# Altium schematic sheet adc_chanels.SchDoc
size A4
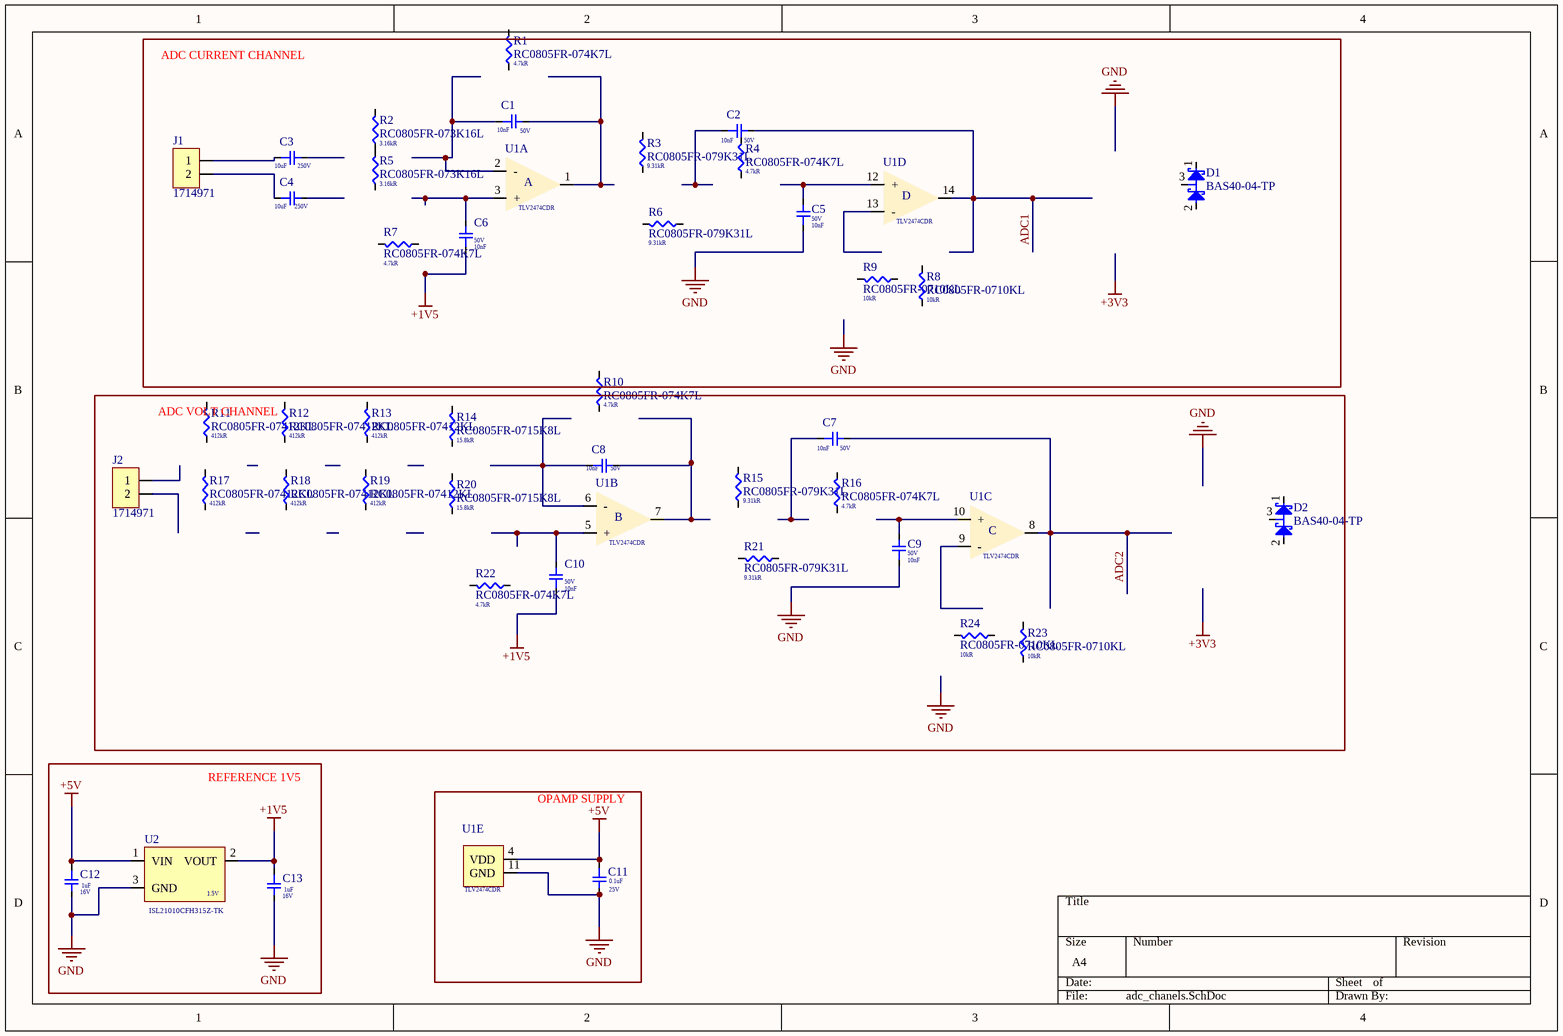
[diagram p0: adc_chanels.SchDoc]

## Parts
C1  Voltage: 50V  Capacitance: 10nF  [CAP smd 0805]  (hidden comment: CAP_GRM2195C1H103FA01D_MURATA)
C2  Voltage: 50V  Capacitance: 10nF  [CAP smd 0805]  (hidden comment: CAP_GRM2195C1H103FA01D_MURATA)
C3  Voltage Rating (AC): 250V  Capacitance: 10uF  [Cap 22x36.5x31.5]  (hidden comment: CAP_B32754C2106K000)
C4  Voltage Rating (AC): 250V  Capacitance: 10uF  [Cap 22x36.5x31.5]  (hidden comment: CAP_B32754C2106K000)
C5  Voltage: 50V  Capacitance: 10nF  [CAP smd 0805]  (hidden comment: CAP_GRM2195C1H103FA01D_MURATA)
C6  Voltage: 50V  Capacitance: 10nF  [CAP smd 0805]  (hidden comment: CAP_GRM2195C1H103FA01D_MURATA)
C7  Voltage: 50V  Capacitance: 10nF  [CAP smd 0805]  (hidden comment: CAP_GRM2195C1H103FA01D_MURATA)
C8  Voltage: 50V  Capacitance: 10nF  [CAP smd 0805]  (hidden comment: CAP_GRM2195C1H103FA01D_MURATA)
C9  Voltage: 50V  Capacitance: 10nF  [CAP smd 0805]  (hidden comment: CAP_GRM2195C1H103FA01D_MURATA)
C10  Voltage: 50V  Capacitance: 10nF  [CAP smd 0805]  (hidden comment: CAP_GRM2195C1H103FA01D_MURATA)
C11  Voltage Rating: 25V  Capacitance: 0.1uF  [CAP smd 0805]  (hidden comment: CAP_CC0805KRX7R8BB104_YAGEO)
C12  Voltage Rating: 16V  Capacitance: 1uF  [CAP smd 0805]  (hidden comment: CAP_CC0805KKX7R7BB105_YAGEO)
C13  Voltage Rating: 16V  Capacitance: 1uF  [CAP smd 0805]  (hidden comment: CAP_CC0805KKX7R7BB105_YAGEO)
D1  BAS40-04-TP  [SOT-23]
D2  BAS40-04-TP  [SOT-23]
J1  1714971
J2  1714971
R1  RC0805FR-074K7L  Resistance: 4.7kR  [res 0805]
R2  RC0805FR-073K16L  Resistance: 3.16kR  [res 0805]
R3  RC0805FR-079K31L  Resistance: 9.31kR  [res 0805]
R4  RC0805FR-074K7L  Resistance: 4.7kR  [res 0805]
R5  RC0805FR-073K16L  Resistance: 3.16kR  [res 0805]
R6  RC0805FR-079K31L  Resistance: 9.31kR  [res 0805]
R7  RC0805FR-074K7L  Resistance: 4.7kR  [res 0805]
R8  RC0805FR-0710KL  Resistance: 10kR  [res 0805]
R9  RC0805FR-0710KL  Resistance: 10kR  [res 0805]
R10  RC0805FR-074K7L  Resistance: 4.7kR  [res 0805]
R11  RC0805FR-07412KL  Resistance: 412kR  [res 0805]
R12  RC0805FR-07412KL  Resistance: 412kR  [res 0805]
R13  RC0805FR-07412KL  Resistance: 412kR  [res 0805]
R14  RC0805FR-0715K8L  Resistance: 15.8kR  [res 0805]
R15  RC0805FR-079K31L  Resistance: 9.31kR  [res 0805]
R16  RC0805FR-074K7L  Resistance: 4.7kR  [res 0805]
R17  RC0805FR-07412KL  Resistance: 412kR  [res 0805]
R18  RC0805FR-07412KL  Resistance: 412kR  [res 0805]
R19  RC0805FR-07412KL  Resistance: 412kR  [res 0805]
R20  RC0805FR-0715K8L  Resistance: 15.8kR  [res 0805]
R21  RC0805FR-079K31L  Resistance: 9.31kR  [res 0805]
R22  RC0805FR-074K7L  Resistance: 4.7kR  [res 0805]
R23  RC0805FR-0710KL  Resistance: 10kR  [res 0805]
R24  RC0805FR-0710KL  Resistance: 10kR  [res 0805]
U1  TLV2474CDR  (value not drawn)  (parts A,B,C,D,E of 5)
U2  Reference Voltage: 1.5V  (hidden comment: ISL21010CFH315Z-TK)

## Blocks framed on the sheet
ADC CURRENT CHANNEL: C1-C6 D1 J1 R1-R9 U1
ADC VOLT CHANNEL: C7-C10 D2 J2 R11-R24 U1
REFERENCE 1V5: C12 C13 U2
OPAMP SUPPLY: C11 U1

## Nets
+1V5: C6.23 C10.23 C13.23 U2.2(VOUT)
+5V: C11.23 C12.23 U1.4(VDD) U2.1(VIN)
GND: C5.23 C9.23 C11.22 C12.22 C13.22 U1.11(GND) U2.3(GND)
ADC1: C2.22 U1.14
ADC2: C7.22 U1.8
NetC1_22: C1.22 U1.1
NetC1_23: C1.23 U1.2(-)
NetC3_23: C3.23 J1.1
NetC4_23: C4.23 J1.2
NetC5_22: C5.22 U1.12(+)
NetC6_22: C6.22 U1.3(+)
NetC8_22: C8.22 U1.7
NetC8_23: C8.23 U1.6(-)
NetC9_22: C9.22 U1.10(+)
NetC10_22: C10.22 U1.5(+)
NetR2_2: R2.2 R5.1

Not connected (* = marked no-connect by the designer): C2 23; C3 22; C4 22; C7 23; D1 1 2 3; D2 1 2 3; J2 1 2; R1 1 2; R2 1; R3 1 2; R4 1 2; R5 2; R6 1 2; R7 1 2; R8 1 2; R9 1 2; R10 1 2; R11 1 2; R12 1 2; R13 1 2; R14 1 2; R15 1 2; R16 1 2; R17 1 2; R18 1 2; R19 1 2; R20 1 2; R21 1 2; R22 1 2; R23 1 2; R24 1 2; U1 9(-) 13(-)

## Notes on the sheet
- (in symbol TLV2474CDR, part A) A
- (in symbol TLV2474CDR, part B) B
- (in symbol TLV2474CDR, part C) C

## Library data of the parts
C1 C2 C5-C10 = CAP_GRM2195C1H103FA01D_MURATA: 0805 10 nF 50 V ±1% Tolerance C0G SMD Multilayer Ceramic Capacitor; Manufacturer 1: Murata; Temperature Coefficient: 30ppm/°C; Supplier 1: Arrow Electronics; Manufacturer Part Number 1: GRM2195C1H103FA01D; Stock 1: 3; Pricing 1: 1=0,54310 (USD); RoHS: Yes; Mount: Surface Mount; Case/Package: 0805; Case Code (Imperial): 0805; Case Code (Metric): 2012; Min Operating Temperature: -55°C; Max Operating Temperature: 125°C; Tolerance: 1%; Dielectric: C0G; Packaging: Tape and Reel; Voltage Rating: 50V; Voltage Rating (DC): 50V; Package Quantity: 4000; Termination: SMD/SMT; Series: GRM; Construction: Flat; Length: 2mm; Width: 1.25mm; Height: 0.85mm; Depth: 1.25mm; Thickness: 0.037inch; Radiation Hardening: No; REACH SVHC: No SVHC; Lead Free: Lead Free; RoHS Compliant: Yes; ComponentLink1URL: https://datasheet.ciiva.com/29542/partnumbering-e-01-29542571.pdf?src-supplier=Digi-Key; ComponentLink1Description: https://datasheet.ciiva.com/29542/partnumbering-e-01-29542571.pdf?src-supplier=Digi-Key; ComponentLink2URL: https://datasheet.ciiva.com/29542/partnumbering-e-01-29542569.pdf?src-supplier=Digi-Key; ComponentLink2Description: https://datasheet.ciiva.com/29542/partnumbering-e-01-29542569.pdf?src-supplier=Digi-Key; ComponentLink3URL: https://datasheet.ciiva.com/29542/partnumbering-e-01-29542570.pdf?src-supplier=Digi-Key; ComponentLink3Description: https://datasheet.ciiva.com/29542/partnumbering-e-01-29542570.pdf?src-supplier=Digi-Key; ComponentLink4URL: https://datasheet.ciiva.com/17452/c02e-17452856.pdf?src-supplier=Avnet+Europe; ComponentLink4Description: https://datasheet.ciiva.com/17452/c02e-17452856.pdf?src-supplier=Avnet+Europe; ComponentLink5URL: https://datasheet.ciiva.com/16497/c02e-16497047.pdf?src-supplier=Future+Electronics; ComponentLink5Description: https://datasheet.ciiva.com/16497/c02e-16497047.pdf?src-supplier=Future+Electronics; Supplier Part Number 1: GRM2195C1H103FA01D
C3 C4 = CAP_B32754C2106K000: Cap Film 10uF 500V PP 10% (31.5 X 22 X 36.5mm) Dipped Radial 27.5mm 105°C Bulk; Manufacturer 1: TDK EPCOS; ESR (Equivalent Series Resistance): 4.2mR; Supplier 1: Digi-Key; Manufacturer Part Number 1: B32754C2106K000; Stock 1: 0; Pricing 1: 1=5,13000, 10=4,62000, 50=4,00380, 100=3,49040, 500=2,87448, 1000=2,66916, 2500=2,61783 (USD); RoHS: No; Mount: Through Hole; Case/Package: Radial; Dielectric Material: PP; Min Operating Temperature: -40°C; Max Operating Temperature: 105°C; Packaging: Bulk; Tolerance: 10%; Voltage Rating (DC): 500V; Termination: PC Pins; RoHS Compliant: No; ComponentLink1URL: https://en.tdk.eu/inf/20/20/ds/MKP_B32754_758.pdf?src-supplier=Digi-Key; ComponentLink1Description: https://en.tdk.eu/inf/20/20/ds/MKP_B32754_758.pdf?src-supplier=Digi-Key; Supplier Part Number 1: 495-76101-ND
C11 = CAP_CC0805KRX7R8BB104_YAGEO: CAPACITOR, 0805, 100NF, 25V, REEL 4000; Manufacturer 1: Yageo; Material: Ceramic; Tolerance: 10%; Dielectric: X7R; Insulation Resistance: 100GR; Supplier 1: Digi-Key; Manufacturer Part Number 1: CC0805KRX7R8BB104; Stock 1: 278639; Pricing 1: 1=0,12000, 10=0,08800, 50=0,04980, 100=0,04130, 500=0,02894, 1000=0,02396 (USD); RoHS: Yes; Mount: Surface Mount; Case/Package: 0805; Number of Pins: 2; Case Code (Metric): 2012; Case Code (Imperial): 0805; Min Operating Temperature: -55°C; Max Operating Temperature: 125°C; Package Quantity: 1; Packaging: Tape and Reel; Voltage Rating (DC): 25V; Termination: SMD/SMT; Resistor Type: Ceramic; Series: CC; Length: 2mm; Width: 0.049inch; Height: 0.85mm; Thickness: 0.033inch; Depth: 1.25mm; Radiation Hardening: No; REACH SVHC: No SVHC; Lead Free: Lead Free; Halogen Free: Halogen Free; RoHS Compliant: Yes; ComponentLink1URL: https://datasheet.ciiva.com/8034/70765-8034031.pdf?src-supplier=Element14; ComponentLink1Description: https://datasheet.ciiva.com/8034/70765-8034031.pdf?src-supplier=Element14; ComponentLink2URL: https://datasheet.ciiva.com/28450/1489800-28450789.pdf?src-supplier=Element14; ComponentLink2Description: https://datasheet.ciiva.com/28450/1489800-28450789.pdf?src-supplier=Element14; ComponentLink3URL: https://datasheet.ciiva.com/46430/1850775-46430166.pdf?src-supplier=Element14; ComponentLink3Description: https://datasheet.ciiva.com/46430/1850775-46430166.pdf?src-supplier=Element14; ComponentLink4URL: https://datasheet.ciiva.com/145/mlccorderingcode-145008.pdf?src-supplier=Digi-Key; ComponentLink4Description: https://datasheet.ciiva.com/145/mlccorderingcode-145008.pdf?src-supplier=Digi-Key; ComponentLink5URL: https://datasheet.ciiva.com/145/mlccorderingcode-145007.pdf?src-supplier=Digi-Key; ComponentLink5Description: https://datasheet.ciiva.com/145/mlccorderingcode-145007.pdf?src-supplier=Digi-Key; ComponentLink6URL: https://datasheet.ciiva.com/145/mlccorderingcode-145009.pdf?src-supplier=Digi-Key; ComponentLink6Description: https://datasheet.ciiva.com/145/mlccorderingcode-145009.pdf?src-supplier=Digi-Key; ComponentLink7URL: https://datasheet.ciiva.com/8034/1784427-8034030.pdf?src-supplier=Element14; ComponentLink7Description: https://datasheet.ciiva.com/8034/1784427-8034030.pdf?src-supplier=Element14; ComponentLink8URL: https://datasheet.ciiva.com/8034/1784427-8034029.pdf?src-supplier=Element14; ComponentLink8Description: https://datasheet.ciiva.com/8034/1784427-8034029.pdf?src-supplier=Element14; ComponentLink9URL: https://datasheet.ciiva.com/15189/getdatasheetpartid-330244-15189223.pdf?src-supplier=Verical; ComponentLink9Description: https://datasheet.ciiva.com/15189/getdatasheetpartid-330244-15189223.pdf?src-supplier=Verical; ComponentLink10URL: https://datasheet.ciiva.com/16625/upy-gphc-x7r-6-3v-to-50v-8-16625546.pdf?src-supplier=Avnet+Europe; ComponentLink10Description: https://datasheet.ciiva.com/16625/upy-gphc-x7r-6-3v-to-50v-8-16625546.pdf?src-supplier=Avnet+Europe; Supplier Part Number 1: 311-1141-1-ND
C12 C13 = CAP_CC0805KKX7R7BB105_YAGEO: YAGEO   CC0805KKX7R7BB105   CERAMIC CAPACITOR, 1UF, 16V, X7R, 10%, 0805; Supplier 1: Digi-Key; Manufacturer 1: Yageo; Manufacturer Part Number 1: CC0805KKX7R7BB105; Stock 1: 516899; Pricing 1: 1=0,16000, 10=0,11700, 50=0,06640, 100=0,05500, 500=0,03858, 1000=0,03194 (USD); RoHS: Yes; Mount: Surface Mount; Case/Package: 0805; Case Code (Metric): 2012; Case Code (Imperial): 0805; Min Operating Temperature: -55°C; Max Operating Temperature: 125°C; Tolerance: 10%; Dielectric: X7R; Series: CC; Packaging: Tape and Reel; Package Quantity: 1; Termination: SMD/SMT; Voltage Rating (DC): 16V; Length: 2mm; Width: 0.049inch; Depth: 1.25mm; Thickness: 0.049inch; Radiation Hardening: No; REACH SVHC: No SVHC; Lead Free: Lead Free; Halogen Free: Halogen Free; RoHS Compliant: Yes; ComponentLink1URL: https://datasheet.ciiva.com/144/mlccorderingcode-144902.pdf?src-supplier=Digi-Key; ComponentLink1Description: https://datasheet.ciiva.com/144/mlccorderingcode-144902.pdf?src-supplier=Digi-Key; ComponentLink2URL: https://datasheet.ciiva.com/144/mlccorderingcode-144903.pdf?src-supplier=Digi-Key; ComponentLink2Description: https://datasheet.ciiva.com/144/mlccorderingcode-144903.pdf?src-supplier=Digi-Key; ComponentLink3URL: https://datasheet.ciiva.com/144/mlccorderingcode-144904.pdf?src-supplier=Digi-Key; ComponentLink3Description: https://datasheet.ciiva.com/144/mlccorderingcode-144904.pdf?src-supplier=Digi-Key; ComponentLink4URL: https://datasheet.ciiva.com/11464/upy-gphc-x7r-6-3v-to-50v-8-11464750.pdf?src-supplier=Avnet; ComponentLink4Description: https://datasheet.ciiva.com/11464/upy-gphc-x7r-6-3v-to-50v-8-11464750.pdf?src-supplier=Avnet; ComponentLink5URL: https://datasheet.ciiva.com/13173/upy-gp-np0-16v-to-50v-8-3714-13173254.pdf?src-supplier=Mouser; ComponentLink5Description: https://datasheet.ciiva.com/13173/upy-gp-np0-16v-to-50v-8-3714-13173254.pdf?src-supplier=Mouser; ComponentLink6URL: https://datasheet.ciiva.com/7978/1489800-7978201.pdf?src-supplier=Element14; ComponentLink6Description: https://datasheet.ciiva.com/7978/1489800-7978201.pdf?src-supplier=Element14; ComponentLink7URL: https://datasheet.ciiva.com/28450/1489800-28450750.pdf?src-supplier=Element14; ComponentLink7Description: https://datasheet.ciiva.com/28450/1489800-28450750.pdf?src-supplier=Element14; ComponentLink8URL: https://datasheet.ciiva.com/15189/getdatasheetpartid-251802-15189206.pdf?src-supplier=Verical; ComponentLink8Description: https://datasheet.ciiva.com/15189/getdatasheetpartid-251802-15189206.pdf?src-supplier=Verical; Supplier Part Number 1: 311-1365-1-ND
D1 D2 = BAS40-04-TP: DIODE ARRAY SCHOTTKY 40V SOT23; Manufacturer 1: MCC; Max Surge Current: 600mA; Recovery Time: 5ns; Forward Current: 200mA; Forward Voltage: 1V; Max Reverse Leakage Current: 200nA; Power Dissipation: 200mW; Element Configuration: Single; Capacitance: 5pF; Supplier 1: Digi-Key; Manufacturer Part Number 1: BAS40-04-TP; Stock 1: 0; Pricing 1: 1=0,26000, 10=0,21300, 100=0,11290, 500=0,07424, 1000=0,05049 (USD); RoHS: Yes; Mount: Surface Mount; Case/Package: SOT-23; Number of Pins: 3; Min Operating Temperature: -55°C; Max Operating Temperature: 125°C; Package Quantity: 3000; Packaging: Tape and Reel; Average Rectified Current: 200mA; Reverse Recovery Time: 5ns; Max Forward Surge Current (Ifsm): 600mA; Max Reverse Current: 200nA; Max Repetitive Reverse Voltage (Vrrm): 40V; Peak Non-Repetitive Surge Current: 600mA; Max Reverse Voltage (DC): 40V; Series: -; Length: 3.04mm; Width: 1.4mm; Height: 1.02mm; Radiation Hardening: No; REACH SVHC: Unknown; Lead Free: Lead Free; RoHS Compliant: Yes; ComponentLink1URL: https://datasheet.ciiva.com/4716/bas40-bas70sot-23-28891-4716000.pdf?src-supplier=Mouser; ComponentLink1Description: https://datasheet.ciiva.com/4716/bas40-bas70sot-23-28891-4716000.pdf?src-supplier=Mouser; ComponentLink2URL: https://datasheet.ciiva.com/23684/1684803-23684306.pdf?src-supplier=Newark; ComponentLink2Description: https://datasheet.ciiva.com/23684/1684803-23684306.pdf?src-supplier=Newark; ComponentLink3URL: https://datasheet.ciiva.com/906/bas40-bas70sot-23-906318.pdf?src-supplier=Digi-Key; ComponentLink3Description: https://datasheet.ciiva.com/906/bas40-bas70sot-23-906318.pdf?src-supplier=Digi-Key; ComponentLink4URL: https://datasheet.ciiva.com/906/bas40-bas70sot-23-906319.pdf?src-supplier=Digi-Key; ComponentLink4Description: https://datasheet.ciiva.com/906/bas40-bas70sot-23-906319.pdf?src-supplier=Digi-Key; ComponentLink5URL: https://datasheet.ciiva.com/906/bas40-bas70sot-23-906320.pdf?src-supplier=Digi-Key; ComponentLink5Description: https://datasheet.ciiva.com/906/bas40-bas70sot-23-906320.pdf?src-supplier=Digi-Key; ComponentLink6URL: https://datasheet.ciiva.com/7624/1684803-7624699.pdf?src-supplier=Element14; ComponentLink6Description: https://datasheet.ciiva.com/7624/1684803-7624699.pdf?src-supplier=Element14; ComponentLink7URL: https://datasheet.ciiva.com/15200/getdatasheetpartid-226544-15200426.pdf?src-supplier=Verical; ComponentLink7Description: https://datasheet.ciiva.com/15200/getdatasheetpartid-226544-15200426.pdf?src-supplier=Verical; Supplier Part Number 1: BAS40-04TPMSDKR-ND
J1 J2 = 1714971: Large Style 2pos 32a 500vac 24-10awg Green Plastic Interlocking Housing 9.5.0mm Pitch; Manufacturer 1: Phoenix Contact; Number of Poles: 2; Voltage Rating: 1kV; Max Supply Voltage: 690V; Number of Levels: 1; Current: 30A; Voltage: 600V; Connector Type: PCB,Terminal Block; Gender: Male; Wire Gauge (Max): 24AWG; Wire Gauge (Min): 10AWG; Pitch: 0.375inch; Stripping Length: 8mm; Approvals: UL,CSA,cULus,EAC; Supplier 1: Digi-Key; Manufacturer Part Number 1: 1714971; Stock 1: 16891; Pricing 1: 1=1,79000, 10=1,74400, 50=1,63000, 100=1,49960, 250=1,38552, 500=1,32030, 1000=1,25510 (USD); RoHS: Yes; Mount: Through Hole; Number of Pins: 2; Color: Green; Weight: 0.228928oz; Housing Color: Green; Housing Material: Polyamide; Insulation Material: Nylon; Contact Material: Tin; Material: Polyamide; Packaging: Bulk; Max Current Rating: 32A; Package Quantity: 50; Number of Rows: 1; Current Rating: 32A; Number of Positions Per Level: 2; Termination: Screw; Number of Positions: 2; Number of Contacts: 2; Number of Circuits: 2; Orientation: Straight; Series: MKDS; Length: 19.04mm; Width: 21.5mm; Height: 21.5mm; Wire/Cable Gauge: 24AWG; Depth: 12.5mm; Radiation Hardening: No; RoHS Compliant: Yes; Lead Free: Lead Free; Flammability Rating: UL94 V-0; REACH SVHC: No SVHC; ComponentLink1URL: https://datasheet.ciiva.com/823/1714971-823798.pdf?src-supplier=Digi-Key; ComponentLink1Description: https://datasheet.ciiva.com/823/1714971-823798.pdf?src-supplier=Digi-Key; ComponentLink2URL: https://datasheet.ciiva.com/16071/1714971-16071957.pdf?src-supplier=Onlinecomponents.com; ComponentLink2Description: https://datasheet.ciiva.com/16071/1714971-16071957.pdf?src-supplier=Onlinecomponents.com; ComponentLink3URL: https://datasheet.ciiva.com/15169/getdatasheetpartid-177884-15169654.pdf?src-supplier=Verical; ComponentLink3Description: https://datasheet.ciiva.com/15169/getdatasheetpartid-177884-15169654.pdf?src-supplier=Verical; ComponentLink4URL: https://datasheet.ciiva.com/1118/100944-1118424.pdf?src-supplier=Element14; ComponentLink4Description: https://datasheet.ciiva.com/1118/100944-1118424.pdf?src-supplier=Element14; ComponentLink5URL: https://datasheet.ciiva.com/29218/744593-da-01-en-printklemme-mkds-5-2-9-5-29218293.pdf?src-supplier=Conrad; ComponentLink5Description: https://datasheet.ciiva.com/29218/744593-da-01-en-printklemme-mkds-5-2-9-5-29218293.pdf?src-supplier=Conrad; Supplier Part Number 1: 277-1271-ND
R1 R4 R7 R10 R16 R22 = RC0805FR-074K7L: YAGEO - RC0805FR-074K7L - SMD  0805 [2012 Metric], 4.7 kohm,  125 mW; Tolerance: 1%; Temperature Coefficient: 100ppm/°C; Voltage Rating (DC): 150V; Power Rating: 125mW; Supplier 1: RSComponents; Manufacturer 1: Yageo; Manufacturer Part Number 1: RC0805FR-074K7L; Stock 1: 55000; Pricing 1: 5000=0,00500 (GBP); RoHS: Yes; Case/Package: 0805; Number of Pins: 2; Case Code (Metric): 2012; Case Code (Imperial): 0805; Size Code: 0805; Min Operating Temperature: -55°C; Max Operating Temperature: 155°C; Resistor Type: Thick Film; Packaging: Tape and Reel; Package Quantity: 5000; Voltage Rating: 150V; Number of Terminations: 2; Termination: SMD/SMT; Max Power Dissipation: 125mW; Features: Moisture Resistant; Series: RC; Resistance Tolerance: 1%; Technology: THICK FILM; Construction: Rectangular; Length: 0.079inch; Width: 0.049inch; Height: 0.024inch; Depth: 1.25mm; REACH SVHC: No SVHC; Lead Free: Lead Free; RoHS Compliant: Yes; Military Standard: Not; ComponentLink1URL: https://datasheet.ciiva.com/11808/0900766b8106beab-11808155.pdf?src-supplier=RSComponents; ComponentLink1Description: https://datasheet.ciiva.com/11808/0900766b8106beab-11808155.pdf?src-supplier=RSComponents; ComponentLink2URL: https://datasheet.ciiva.com/6547/pyu-r-int-thick-7-6547263.pdf?src-supplier=Digi-Key; ComponentLink2Description: https://datasheet.ciiva.com/6547/pyu-r-int-thick-7-6547263.pdf?src-supplier=Digi-Key; ComponentLink3URL: https://datasheet.ciiva.com/7941/444164-7941806.pdf?src-supplier=Element14; ComponentLink3Description: https://datasheet.ciiva.com/7941/444164-7941806.pdf?src-supplier=Element14; ComponentLink4URL: https://datasheet.ciiva.com/46447/444164-46447583.pdf?src-supplier=Element14; ComponentLink4Description: https://datasheet.ciiva.com/46447/444164-46447583.pdf?src-supplier=Element14; ComponentLink5URL: https://datasheet.ciiva.com/7941/444164-7941804.pdf?src-supplier=Element14; ComponentLink5Description: https://datasheet.ciiva.com/7941/444164-7941804.pdf?src-supplier=Element14; ComponentLink6URL: https://datasheet.ciiva.com/7941/1686128-7941805.pdf?src-supplier=Element14; ComponentLink6Description: https://datasheet.ciiva.com/7941/1686128-7941805.pdf?src-supplier=Element14; Supplier Part Number 1: 6181408
R2 R5 = RC0805FR-073K16L: Res Thick Film smd 0805 3.16K Ohm 1% 0.125W(1/8W); Manufacturer 1: Yageo; Power Rating: 125mW; Voltage Rating: 150V; Temperature Coefficient: 100ppm/°C; Supplier 1: Digi-Key; Manufacturer Part Number 1: RC0805FR-073K16L; Stock 1: 24399; Pricing 1: 1=0,10000, 10=0,04200, 100=0,01690, 1000=0,00759, 2500=0,00659 (USD); RoHS: Yes; Case/Package: 0805; Case Code (Metric): 2012; Case Code (Imperial): 0805; Weight: 0.000194oz; Size Code: 0805; Min Operating Temperature: -55°C; Max Operating Temperature: 155°C; Tolerance: 1%; Package Quantity: 1; Packaging: Tape and Reel; Resistor Type: Thick Film; Number of Terminations: 2; Termination: SMD/SMT; Max Power Dissipation: 125mW; Voltage Rating (DC): 150V; Features: Moisture Resistant; Series: RC; Construction: Rectangular; Length: 2mm; Width: 0.049inch; Height: 0.024inch; Depth: 1.25mm; Military Standard: Not; Lead Free: Lead Free; RoHS Compliant: Yes; ComponentLink1URL: https://datasheet.ciiva.com/2457/pyu-r-int-thick-7-2457284.pdf?src-supplier=Digi-Key; ComponentLink1Description: https://datasheet.ciiva.com/2457/pyu-r-int-thick-7-2457284.pdf?src-supplier=Digi-Key; ComponentLink2URL: https://datasheet.ciiva.com/2457/pyu-r-int-thick-7-2457285.pdf?src-supplier=Digi-Key; ComponentLink2Description: https://datasheet.ciiva.com/2457/pyu-r-int-thick-7-2457285.pdf?src-supplier=Digi-Key; ComponentLink3URL: https://datasheet.ciiva.com/2457/pyu-r-int-thick-7-2457286.pdf?src-supplier=Digi-Key; ComponentLink3Description: https://datasheet.ciiva.com/2457/pyu-r-int-thick-7-2457286.pdf?src-supplier=Digi-Key; ComponentLink4URL: https://datasheet.ciiva.com/12577/rc0805-12577436.pdf?src-supplier=Mouser; ComponentLink4Description: https://datasheet.ciiva.com/12577/rc0805-12577436.pdf?src-supplier=Mouser; Supplier Part Number 1: 311-3.16KCRCT-ND
R3 R6 R15 R21 = RC0805FR-079K31L: Res Thick Film smd 0805 9.31K Ohm 1% 0.125W(1/8W); Manufacturer 1: Yageo; Temperature Coefficient: 100ppm/°C; Power Rating: 125mW; Voltage Rating: 150V; Supplier 1: Digi-Key; Manufacturer Part Number 1: RC0805FR-079K31L; Stock 1: 10181; Pricing 1: 1=0,10000, 10=0,04200, 100=0,01690, 1000=0,00759, 2500=0,00659 (USD); RoHS: Yes; Case/Package: 0805; Contact Plating: Tin,Lead,Matte; Case Code (Imperial): 0805; Case Code (Metric): 2012; Size Code: 0805; Min Operating Temperature: -55°C; Max Operating Temperature: 155°C; Tolerance: 1%; Resistor Type: Thick Film; Packaging: Tape and Reel; Package Quantity: 1; Termination: SMD/SMT; Number of Terminations: 2; Max Power Dissipation: 125mW; Voltage Rating (DC): 150V; Features: Moisture Resistant; Series: RC; Construction: Rectangular; Length: 2mm; Width: 1.25mm; Height: 0.024inch; Depth: 1.25mm; Radiation Hardening: No; Military Standard: Not; Lead Free: Lead Free; RoHS Compliant: Yes; ComponentLink1URL: https://datasheet.ciiva.com/2457/pyu-r-int-thick-7-2457635.pdf?src-supplier=Digi-Key; ComponentLink1Description: https://datasheet.ciiva.com/2457/pyu-r-int-thick-7-2457635.pdf?src-supplier=Digi-Key; ComponentLink2URL: https://datasheet.ciiva.com/2457/pyu-r-int-thick-7-2457636.pdf?src-supplier=Digi-Key; ComponentLink2Description: https://datasheet.ciiva.com/2457/pyu-r-int-thick-7-2457636.pdf?src-supplier=Digi-Key; ComponentLink3URL: https://datasheet.ciiva.com/2457/pyu-r-int-thick-7-2457637.pdf?src-supplier=Digi-Key; ComponentLink3Description: https://datasheet.ciiva.com/2457/pyu-r-int-thick-7-2457637.pdf?src-supplier=Digi-Key; ComponentLink4URL: https://datasheet.ciiva.com/17074/rc0805-17074679.pdf?src-supplier=Future+Electronics; ComponentLink4Description: https://datasheet.ciiva.com/17074/rc0805-17074679.pdf?src-supplier=Future+Electronics; Supplier Part Number 1: 311-9.31KCRCT-ND
R8 R9 R23 R24 = RC0805FR-0710KL: RES SMD  0805 10K OHM 1% 1/8W; Manufacturer 1: Yageo; Temperature Coefficient: 100ppm/°C; Power Rating: 125mW; Voltage Rating: 150V; Supplier 1: Digi-Key; Manufacturer Part Number 1: RC0805FR-0710KL; Stock 1: 7813114; Pricing 1: 1=0,10000, 10=0,04200, 100=0,01690, 1000=0,00759, 2500=0,00659 (USD); RoHS: Yes; Case/Package: 0805; Case Code (Imperial): 0805; Case Code (Metric): 2012; Size Code: 0805; Min Operating Temperature: -55°C; Max Operating Temperature: 155°C; Tolerance: 1%; Resistor Type: Thick Film; Packaging: Tape and Reel; Package Quantity: 1; Termination: SMD/SMT; Number of Terminations: 2; Max Power Dissipation: 125mW; Features: Moisture Resistant; Series: RC; Construction: Rectangular; Resistance Tolerance: 1%; Technology: THICK FILM; Length: 2mm; Width: 0.049inch; Height: 0.024inch; Depth: 1.25mm; REACH SVHC: Unknown; Military Standard: Not; Lead Free: Lead Free; RoHS Compliant: Yes; ComponentLink1URL: https://datasheet.ciiva.com/11808/0900766b8106beab-11808151.pdf?src-supplier=RSComponents; ComponentLink1Description: https://datasheet.ciiva.com/11808/0900766b8106beab-11808151.pdf?src-supplier=RSComponents; ComponentLink2URL: https://datasheet.ciiva.com/12669/rc0805-12669688.pdf?src-supplier=Mouser; ComponentLink2Description: https://datasheet.ciiva.com/12669/rc0805-12669688.pdf?src-supplier=Mouser; ComponentLink3URL: https://datasheet.ciiva.com/2456/pyu-r-int-thick-7-2456974.pdf?src-supplier=Digi-Key; ComponentLink3Description: https://datasheet.ciiva.com/2456/pyu-r-int-thick-7-2456974.pdf?src-supplier=Digi-Key; ComponentLink4URL: https://datasheet.ciiva.com/2456/pyu-r-int-thick-7-2456972.pdf?src-supplier=Digi-Key; ComponentLink4Description: https://datasheet.ciiva.com/2456/pyu-r-int-thick-7-2456972.pdf?src-supplier=Digi-Key; ComponentLink5URL: https://datasheet.ciiva.com/2456/pyu-r-int-thick-7-2456973.pdf?src-supplier=Digi-Key; ComponentLink5Description: https://datasheet.ciiva.com/2456/pyu-r-int-thick-7-2456973.pdf?src-supplier=Digi-Key; ComponentLink6URL: https://datasheet.ciiva.com/16747/rc0805-16747087.pdf?src-supplier=Future+Electronics; ComponentLink6Description: https://datasheet.ciiva.com/16747/rc0805-16747087.pdf?src-supplier=Future+Electronics; ComponentLink7URL: https://datasheet.ciiva.com/46447/444164-46447563.pdf?src-supplier=Element14; ComponentLink7Description: https://datasheet.ciiva.com/46447/444164-46447563.pdf?src-supplier=Element14; Supplier Part Number 1: 311-10.0KCRCT-ND
R11-R13 R17-R19 = RC0805FR-07412KL: RES SMD 0805 412K OHM 1% 1/8W; Manufacturer 1: Yageo; Power Rating: 125mW; Voltage Rating: 150V; Temperature Coefficient: 100ppm/°C; Supplier 1: Digi-Key; Manufacturer Part Number 1: RC0805FR-07412KL; Stock 1: 1412; Pricing 1: 1=0,10000, 10=0,04200, 100=0,01690, 1000=0,00759, 2500=0,00659 (USD); RoHS: Yes; Case/Package: 0805; Case Code (Imperial): 0805; Case Code (Metric): 2012; Min Operating Temperature: -55°C; Max Operating Temperature: 155°C; Packaging: Tape and Reel; Tolerance: 1%; Termination: SMD/SMT; Resistor Type: Thick Film; Voltage Rating (DC): 150V; Working Voltage: 150V; Number of Terminations: 2; Features: Moisture Resistant; Series: RC; Max Power Dissipation: 125mW; Technology: THICK FILM; Construction: Rectangular; Length: 2mm; Width: 1.25mm; Height: 0.5mm; Depth: 1.25mm; Military Standard: Not; Lead Free: Lead Free; RoHS Compliant: Yes; ComponentLink1URL: http://www.mouser.com/ds/2/447/Yageo_08112016_RC0805-968729.pdf?src-supplier=Mouser; ComponentLink1Description: http://www.mouser.com/ds/2/447/Yageo_08112016_RC0805-968729.pdf?src-supplier=Mouser; ComponentLink2URL: http://components.arrow.com/part/dataview/0323_03542655?src-supplier=Arrow+Europe; ComponentLink2Description: http://components.arrow.com/part/dataview/0323_03542655?src-supplier=Arrow+Europe; ComponentLink3URL: http://www.yageo.com/documents/recent/PYu-RC_Group_51_RoHS_L_9.pdf?src-supplier=Digi-Key; ComponentLink3Description: http://www.yageo.com/documents/recent/PYu-RC_Group_51_RoHS_L_9.pdf?src-supplier=Digi-Key; ComponentLink4URL: http://www.yageo.com/documents/recent/PYu-RC_Group_51_RoHS_L_10.pdf?src-supplier=Digi-Key; ComponentLink4Description: http://www.yageo.com/documents/recent/PYu-RC_Group_51_RoHS_L_10.pdf?src-supplier=Digi-Key; ComponentLink5URL: http://www.yageo.com/documents/recent/PYu-RC0805_51_RoHS_L_v5.pdf?src-supplier=Future+Electronics; ComponentLink5Description: http://www.yageo.com/documents/recent/PYu-RC0805_51_RoHS_L_v5.pdf?src-supplier=Future+Electronics; Supplier Part Number 1: 311-412KCRCT-ND
R14 R20 = RC0805FR-0715K8L: Res Thick Film smd 0805 15.8K Ohm 1% 0.125W(1/8W); Manufacturer 1: Yageo; Temperature Coefficient: 100ppm/°C; Power Rating: 125mW; Voltage Rating: 150V; Supplier 1: Digi-Key; Manufacturer Part Number 1: RC0805FR-0715K8L; Stock 1: 65412; Pricing 1: 1=0,10000, 10=0,04200, 100=0,01690, 1000=0,00759, 2500=0,00659 (USD); RoHS: Yes; Case/Package: 0805; Contact Plating: Tin,Matte,Lead; Case Code (Imperial): 0805; Case Code (Metric): 2012; Size Code: 0805; Min Operating Temperature: -55°C; Max Operating Temperature: 155°C; Tolerance: 1%; Resistor Type: Thick Film; Packaging: Tape and Reel; Termination: SMD/SMT; Voltage Rating (DC): 150V; Features: Moisture Resistant; Series: RC; Max Power Dissipation: 125mW; Number of Terminations: 2; Construction: Rectangular; Length: 2mm; Depth: 1.25mm; Radiation Hardening: No; Military Standard: Not; Lead Free: Lead Free; RoHS Compliant: Yes; ComponentLink1URL: https://datasheet.ciiva.com/5558/rc0805-5558198.pdf?src-supplier=Mouser; ComponentLink1Description: https://datasheet.ciiva.com/5558/rc0805-5558198.pdf?src-supplier=Mouser; ComponentLink2URL: https://datasheet.ciiva.com/17054/rc0805-17054650.pdf?src-supplier=Future+Electronics; ComponentLink2Description: https://datasheet.ciiva.com/17054/rc0805-17054650.pdf?src-supplier=Future+Electronics; Supplier Part Number 1: 311-15.8KCRCT-ND
U1 = TLV2474CDR: OP Amp Quad GP R-R I/O ±3V/6V 14-Pin SOIC T/R; Manufacturer 1: Texas Instruments; Operating Supply Voltage: 3V; Unity Gain Bandwidth Product: 2.8MHz; Max Supply Voltage: 6V; Min Supply Voltage: 2.7V; Min Dual Supply Voltage: 1.35V; Voltage Gain: 120dB; Output Current: 35mA; Nominal Supply Current: 3.6mA; Common Mode Rejection Ratio: 61dB; Number of Channels: 4; Slew Rate: 1.4V/µs; Max I/O Voltage: 2.2mV; Input Bias Current: 50pA; Operating Supply Current: 600uA; Power Dissipation: 1.022W; Amplifier Type: GENERAL PURPOSE; Supplier 1: Digi-Key; Manufacturer Part Number 1: TLV2474CDR; Stock 1: 454; Pricing 1: 1=3,32000, 10=2,98200, 25=2,81920, 100=2,44320, 250=2,31792, 500=2,07984, 1000=2,06850 (USD); RoHS: Yes; Case/Package: D; Number of Pins: 14; Contact Plating: Gold; Min Operating Temperature: -40°C; Max Operating Temperature: 125°C; Max Dual Supply Voltage: 3V; Packaging: Tape and Reel; Package Quantity: 2500; Number of Circuits: 4; Gain Bandwidth Product: 2.8MHz; Input Offset Voltage (Vos): 2.2mV; Output Current per Channel: 35mA; Number of Elements: 4; Bandwidth: 2.8MHz; Supply Current: 3.6mA; Technology: CMOS; Max Power Dissipation: 1.022W; Radiation Hardening: No; Lead Free: Lead Free; RoHS Compliant: Yes; ComponentLink1URL: https://datasheet.ciiva.com/15129/getdatasheetpartid-48315-15129799.pdf?src-supplier=Verical; ComponentLink1Description: https://datasheet.ciiva.com/15129/getdatasheetpartid-48315-15129799.pdf?src-supplier=Verical; ComponentLink2URL: https://datasheet.ciiva.com/1799/tlv2474-1799250.pdf?src-supplier=Digi-Key; ComponentLink2Description: https://datasheet.ciiva.com/1799/tlv2474-1799250.pdf?src-supplier=Digi-Key; ComponentLink3URL: https://datasheet.ciiva.com/1799/tlv2474-1799251.pdf?src-supplier=Digi-Key; ComponentLink3Description: https://datasheet.ciiva.com/1799/tlv2474-1799251.pdf?src-supplier=Digi-Key; ComponentLink4URL: https://datasheet.ciiva.com/1799/tlv2474-1799252.pdf?src-supplier=Digi-Key; ComponentLink4Description: https://datasheet.ciiva.com/1799/tlv2474-1799252.pdf?src-supplier=Digi-Key; ComponentLink5URL: https://datasheet.ciiva.com/14461/tlv2475a-14461878.pdf?src-supplier=Avnet; ComponentLink5Description: https://datasheet.ciiva.com/14461/tlv2475a-14461878.pdf?src-supplier=Avnet; ComponentLink6URL: https://datasheet.ciiva.com/26226/tlv2475a-26226316.pdf?src-supplier=Avnet+Europe; ComponentLink6Description: https://datasheet.ciiva.com/26226/tlv2475a-26226316.pdf?src-supplier=Avnet+Europe; Supplier Part Number 1: 296-2442-1-ND
U2 = ISL21010CFH315Z-TK: INTERSIL         ISL21010CFH315Z-TK             Voltage Reference, Precision Micropower, Series - Fixed, ISL21010 Series, 1.5V, SOT-23-3; Max Input Voltage: 6.5V; Max Output Current: 25mA; Tolerance: 0.2%; Temperature Coefficient: 50ppm/°C; Operating Supply Current: 100uA; Number of Channels: 1; Min Input Voltage: 2.2V; Quiescent Current: 80uA; Max Supply Voltage: 5.5V; Supplier 1: Avnet; Manufacturer 1: Intersil; Stock 1: 0; Pricing 1: 2000=0,81760, 4000=0,80080, 6000=0,78400, 10000=0,76720, 20000=0,75040, 100000=0,73360, 200000=0,71680 (USD); RoHS: Yes; Mount: Surface Mount; Case/Package: TO-236-3; Number of Pins: 3; Min Operating Temperature: -40°C; Max Operating Temperature: 125°C; Output Voltage: 1.5V; Packaging: Cut Tape; Min Output Voltage: 1.5V; Output Current: 25mA; Reference Type: Series; Output Type: Fixed; Package Quantity: 1000; Max Supply Current: 100uA; Radiation Hardening: No; REACH SVHC: No SVHC; Lead Free: Lead Free; ComponentLink1URL: https://datasheet.ciiva.com/17218/fn7896-17218418.pdf?src-supplier=Avnet+Europe; ComponentLink1Description: https://datasheet.ciiva.com/17218/fn7896-17218418.pdf?src-supplier=Avnet+Europe; ComponentLink2URL: https://datasheet.ciiva.com/15062/fn7896-15062646.pdf?src-supplier=Digi-Key; ComponentLink2Description: https://datasheet.ciiva.com/15062/fn7896-15062646.pdf?src-supplier=Digi-Key; ComponentLink3URL: https://datasheet.ciiva.com/15062/fn7896-15062647.pdf?src-supplier=Digi-Key; ComponentLink3Description: https://datasheet.ciiva.com/15062/fn7896-15062647.pdf?src-supplier=Digi-Key; ComponentLink4URL: https://datasheet.ciiva.com/22734/1599533-22734604.pdf?src-supplier=Element14; ComponentLink4Description: https://datasheet.ciiva.com/22734/1599533-22734604.pdf?src-supplier=Element14; Supplier Part Number 1: ISL21010CFH315Z-TK; Manufacturer Part Number 1: ISL21010CFH315Z-TK